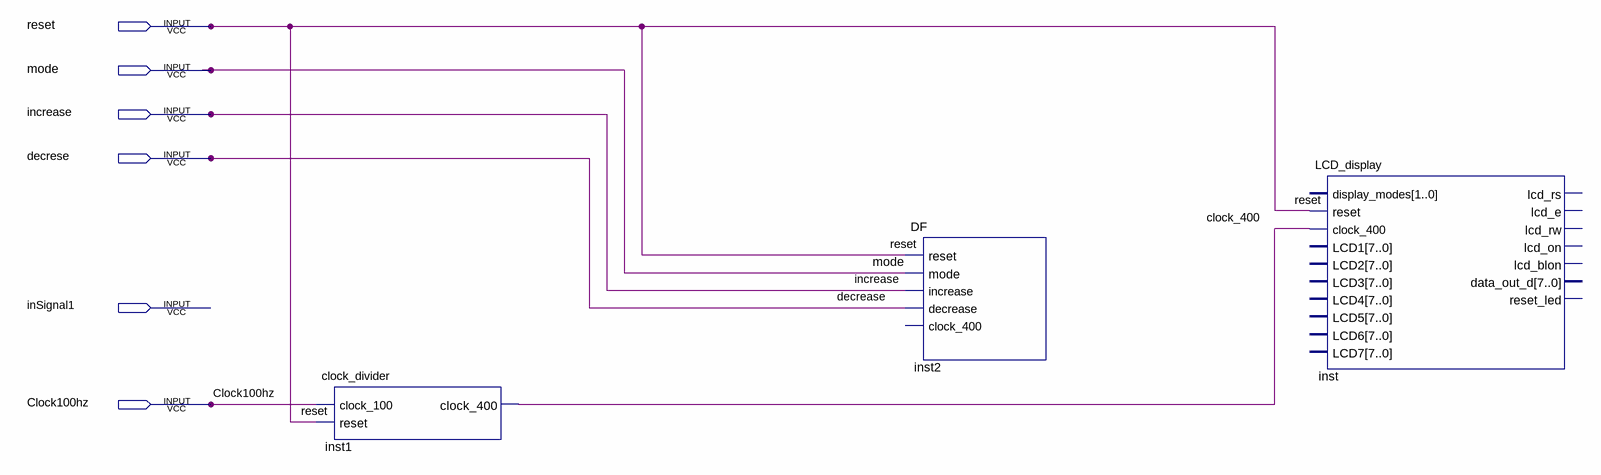
[diagram p0: schematic sheet]
// Quartus schematic main.bdf as structural Verilog: 3 symbols, 6 pins
module main (
  input  reset,
  input  mode,
  input  increase,
  input  decrese,
  input  inSignal1,
  input  Clock100hz
);

  wire clock_400;

  clock_divider inst1 (.clock_100(Clock100hz), .reset(reset), .clock_400(clock_400));
  DF inst2 (.reset(reset), .mode(mode), .increase(increase), .decrease(decrese));  // open: clock_400
  LCD_display inst (
    .reset(reset), .clock_400(clock_400));  // open: display_modes, LCD1, LCD2, LCD3, LCD4, LCD5, LCD6, LCD7, lcd_rs, lcd_e, lcd_rw, lcd_on, lcd_blon, reset_led, data_out_d

  // Other names for the same wires on the sheet: decrease = decrese
endmodule
